# Altium schematic sheet fpga.SchDoc
size A3
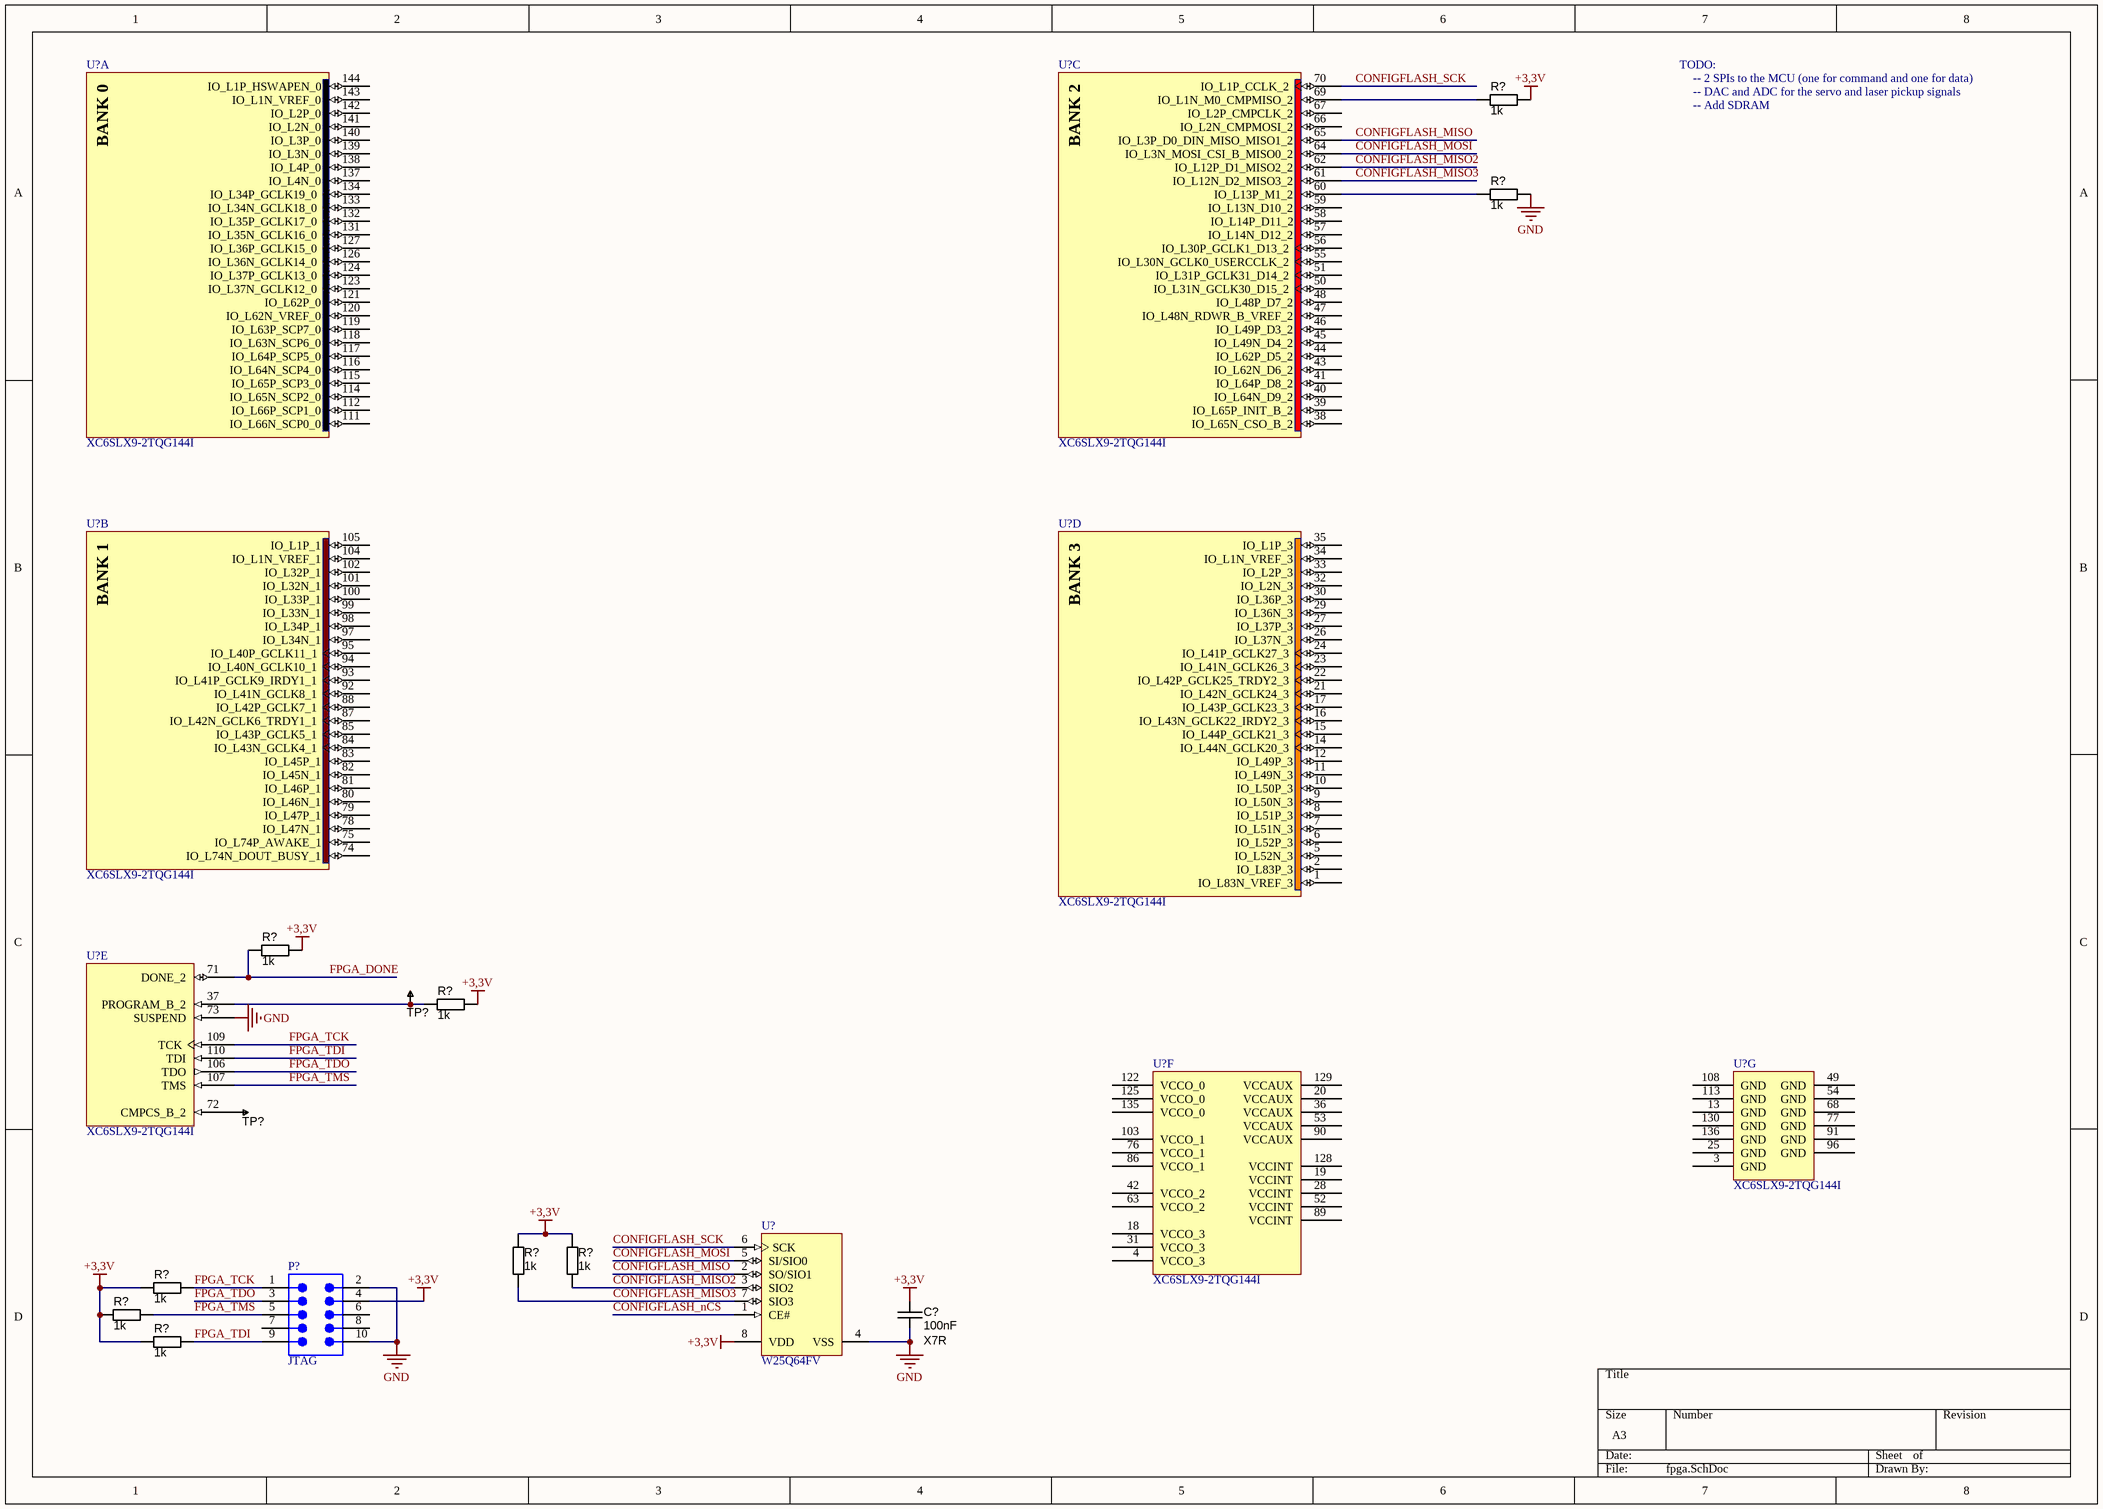
[diagram p0: fpga.SchDoc]

## Parts
(Parts that share a designator on the sheet are numbered #1, #2 ... from top to bottom, then left to right.)
C?  value 100nF  Temperature Coefficient: X7R  [CAPC2012X135N]  (hidden comment: 0805)
P?  JTAG  [918510x324]
R?#1  value 1k  [RESC2012N_ZERO]  (hidden comment: 0805)
R?#2  value 1k  [RESC2012N_ZERO]  (hidden comment: 0805)
R?#3  value 1k  [RESC2012N_ZERO]  (hidden comment: 0805)
R?#4  value 1k  [RESC2012N_ZERO]  (hidden comment: 0805)
R?#5  value 1k  [RESC2012N_ZERO]  (hidden comment: 0805)
R?#6  value 1k  [RESC2012N_ZERO]  (hidden comment: 0805)
R?#7  value 1k  [RESC2012N_ZERO]  (hidden comment: 0805)
R?#8  value 1k  [RESC2012N_ZERO]  (hidden comment: 0805)
R?#9  value 1k  [RESC2012N_ZERO]  (hidden comment: 0805)
TP?#1  TESTPOINT  [TP-R60]  (value not drawn)  (no BOM)
TP?#2  TESTPOINT  [TP-R60]  (value not drawn)  (no BOM)
U?#1  XC6SLX9-2TQG144I  [TQG144_M]  (part A of 7)
U?#2  XC6SLX9-2TQG144I  [TQG144_M]  (part C of 7)
U?#3  XC6SLX9-2TQG144I  [TQG144_M]  (part B of 7)
U?#4  XC6SLX9-2TQG144I  [TQG144_M]  (part D of 7)
U?#5  XC6SLX9-2TQG144I  [TQG144_M]  (part E of 7)
U?#6  XC6SLX9-2TQG144I  [TQG144_M]  (part F of 7)
U?#7  XC6SLX9-2TQG144I  [TQG144_M]  (part G of 7)
U?#8  W25Q64FV  [MCHP-SOIC-S2A8_M]

## Nets
+3,3V: C?.2 P?.4 R?#1.1 R?#3.1 R?#4.1 R?#5.2 R?#6.2 R?#7.1 R?#8.1 R?#9.1 U?#8.8(VDD)
GND: C?.1 P?.2 P?.10 R?#2.1 U?#5.73(SUSPEND) U?#8.4(VSS)
CONFIGFLASH_MISO: U?#2.65(IO_L3P_D0_DIN_MISO_MISO1_2) U?#8.2(SO/SIO1)
CONFIGFLASH_MISO2: R?#6.1 U?#2.62(IO_L12P_D1_MISO2_2) U?#8.3(SIO2)
CONFIGFLASH_MISO3: R?#5.1 U?#2.61(IO_L12N_D2_MISO3_2) U?#8.7(SIO3)
CONFIGFLASH_MOSI: U?#2.64(IO_L3N_MOSI_CSI_B_MISO0_2) U?#8.5(SI/SIO0)
CONFIGFLASH_nCS: U?#8.1(CE#)
CONFIGFLASH_SCK: U?#2.70(IO_L1P_CCLK_2) U?#8.6(SCK)
FPGA_DONE: R?#3.2 U?#5.71(DONE_2)
FPGA_TCK: P?.1 R?#7.2 U?#5.109(TCK)
FPGA_TDI: P?.9 R?#9.2 U?#5.110(TDI)
FPGA_TDO: P?.3 U?#5.106(TDO)
FPGA_TMS: P?.5 R?#8.2 U?#5.107(TMS)
NetR?#1_2: R?#1.2 U?#2.69(IO_L1N_M0_CMPMISO_2)
NetR?#2_2: R?#2.2 U?#2.60(IO_L13P_M1_2)
NetR?#4_2: R?#4.2 TP?#1.1 U?#5.37(PROGRAM_B_2)
NetTP?#2_1: TP?#2.1 U?#5.72(CMPCS_B_2)

Not connected (* = marked no-connect by the designer): P? 6 7 8; U?#1 111(IO_L66N_SCP0_0) 112(IO_L66P_SCP1_0) 114(IO_L65N_SCP2_0) 115(IO_L65P_SCP3_0) 116(IO_L64N_SCP4_0) 117(IO_L64P_SCP5_0) 118(IO_L63N_SCP6_0) 119(IO_L63P_SCP7_0) 120(IO_L62N_VREF_0) 121(IO_L62P_0) 123(IO_L37N_GCLK12_0) 124(IO_L37P_GCLK13_0) 126(IO_L36N_GCLK14_0) 127(IO_L36P_GCLK15_0) 131(IO_L35N_GCLK16_0) 132(IO_L35P_GCLK17_0) 133(IO_L34N_GCLK18_0) 134(IO_L34P_GCLK19_0) 137(IO_L4N_0) 138(IO_L4P_0) 139(IO_L3N_0) 140(IO_L3P_0) 141(IO_L2N_0) 142(IO_L2P_0) 143(IO_L1N_VREF_0) 144(IO_L1P_HSWAPEN_0); U?#2 38(IO_L65N_CSO_B_2) 39(IO_L65P_INIT_B_2) 40(IO_L64N_D9_2) 41(IO_L64P_D8_2) 43(IO_L62N_D6_2) 44(IO_L62P_D5_2) 45(IO_L49N_D4_2) 46(IO_L49P_D3_2) 47(IO_L48N_RDWR_B_VREF_2) 48(IO_L48P_D7_2) 50(IO_L31N_GCLK30_D15_2) 51(IO_L31P_GCLK31_D14_2) 55(IO_L30N_GCLK0_USERCCLK_2) 56(IO_L30P_GCLK1_D13_2) 57(IO_L14N_D12_2) 58(IO_L14P_D11_2) 59(IO_L13N_D10_2) 66(IO_L2N_CMPMOSI_2) 67(IO_L2P_CMPCLK_2); U?#3 74(IO_L74N_DOUT_BUSY_1) 75(IO_L74P_AWAKE_1) 78(IO_L47N_1) 79(IO_L47P_1) 80(IO_L46N_1) 81(IO_L46P_1) 82(IO_L45N_1) 83(IO_L45P_1) 84(IO_L43N_GCLK4_1) 85(IO_L43P_GCLK5_1) 87(IO_L42N_GCLK6_TRDY1_1) 88(IO_L42P_GCLK7_1) 92(IO_L41N_GCLK8_1) 93(IO_L41P_GCLK9_IRDY1_1) 94(IO_L40N_GCLK10_1) 95(IO_L40P_GCLK11_1) 97(IO_L34N_1) 98(IO_L34P_1) 99(IO_L33N_1) 100(IO_L33P_1) 101(IO_L32N_1) 102(IO_L32P_1) 104(IO_L1N_VREF_1) 105(IO_L1P_1); U?#4 1(IO_L83N_VREF_3) 2(IO_L83P_3) 5(IO_L52N_3) 6(IO_L52P_3) 7(IO_L51N_3) 8(IO_L51P_3) 9(IO_L50N_3) 10(IO_L50P_3) 11(IO_L49N_3) 12(IO_L49P_3) 14(IO_L44N_GCLK20_3) 15(IO_L44P_GCLK21_3) 16(IO_L43N_GCLK22_IRDY2_3) 17(IO_L43P_GCLK23_3) 21(IO_L42N_GCLK24_3) 22(IO_L42P_GCLK25_TRDY2_3) 23(IO_L41N_GCLK26_3) 24(IO_L41P_GCLK27_3) 26(IO_L37N_3) 27(IO_L37P_3) 29(IO_L36N_3) 30(IO_L36P_3) 32(IO_L2N_3) 33(IO_L2P_3) 34(IO_L1N_VREF_3) 35(IO_L1P_3); U?#6 4(VCCO_3) 18(VCCO_3) 19(VCCINT) 20(VCCAUX) 28(VCCINT) 31(VCCO_3) 36(VCCAUX) 42(VCCO_2) 52(VCCINT) 53(VCCAUX) 63(VCCO_2) 76(VCCO_1) 86(VCCO_1) 89(VCCINT) 90(VCCAUX) 103(VCCO_1) 122(VCCO_0) 125(VCCO_0) 128(VCCINT) 129(VCCAUX) 135(VCCO_0); U?#7 3(GND) 13(GND) 25(GND) 49(GND) 54(GND) 68(GND) 77(GND) 91(GND) 96(GND) 108(GND) 113(GND) 130(GND) 136(GND)

## Notes on the sheet
- TODO:
- -- Add SDRAM
- -- 2 SPIs to the MCU (one for command and one for data)
- -- DAC and ADC for the servo and laser pickup signals
- (in symbol XC6SLX9-2TQG144I, part A) BANK 0
- (in symbol XC6SLX9-2TQG144I, part B) BANK 1
- (in symbol XC6SLX9-2TQG144I, part C) BANK 2
- (in symbol XC6SLX9-2TQG144I, part D) BANK 3

## Library data of the parts
C? = CAPC_1u_0805_X7R_16V_10%: Capacitor SMD Cer X7R 0805; Tolerance: ±10%; Ratings: 16V; X7R; Material: ceramic; SCDType: spec; Package / Case: 0805 (2012 metric)
P? = 09 18 510 6324: Flat Cable Connector (IDC), Low-Profile Male Header, Straight Solder Pin, 10 Contacts, Performance Level 2; PCB_Layout: Complies with manufacturer's recommendation.; DrillSize: Corresponds to nominal value.; Published: 15-Nov-2004; DatasheetDocument: Sep-2003; PackageDocument: 03-Jun-2003; PackageReference: 918510x324; Publisher: Altium Limited; ComponentLink1Description: Manufacturer Link; ComponentLink1URL: http://www.harting.com/; ComponentLink2Description: Selection Guide; ComponentLink2URL: http://www.harting.com/imperia/md/content/steckverbinderundsystemkomponenten/folder/interface_engl_chapter_09.pdf
R?#1-R?#9 = RES_0R_0805: Resistor SMD chip 0.0 Ohm 0.125W 0805; Manufacturer 1: Samsung Electro-Mechanics America, Inc; Manufacturer Part Number 1: RC2012J000CS; Ratings: 1/8W; SCDType: spec; Tolerance: N/A; Package / Case: 0805 (2012 metric); Supplier 1: Digi-Key; Supplier Part Number 1: 1276-5466-6-ND; RoHS 1: RoHS Compliant; ComponentLink1URL: http://www.samsungsem.com/servlet/FileDownload?filename=productcatalog/pdf/Chip_Resistor.pdf; ComponentLink1Description: http://www.samsungsem.com/servlet/FileDownload?filename=productcatalog/pdf/Chip_Resistor.pdf; Supplier 2: Digi-Key; Supplier Part Number 2: RMCF0805ZT0R00DKR-ND; Manufacturer 2: Stackpole Electronics Inc; Manufacturer Part Number 2: RMCF0805ZT0R00; RoHS 2: RoHS Compliant; ComponentLink2URL: http://www.seielect.com/Catalog/SEI-RMCF_RMCP.pdf; ComponentLink2Description: http://www.seielect.com/Catalog/SEI-RMCF_RMCP.pdf; Supplier 3: Digi-Key; Supplier Part Number 3: 311-0.0ARDKR-ND; Manufacturer 3: Yageo; Manufacturer Part Number 3: RC0805JR-070RL; RoHS 3: RoHS Compliant; ComponentLink3URL: http://media.digikey.com/pdf/Data%20Sheets/Yageo%20PDFs/RC0805%20Pb%20Free.pdf; ComponentLink3Description: http://media.digikey.com/pdf/Data%20Sheets/Yageo%20PDFs/RC0805%20Pb%20Free.pdf; Supplier 4: Digi-Key; Supplier Part Number 4: P0.0ADKR-ND; Manufacturer 4: Panasonic Electronic Components; Manufacturer Part Number 4: ERJ-6GEY0R00V; RoHS 4: RoHS Compliant; ComponentLink4URL: http://industrial.panasonic.com/www-cgi/jvcr13pz.cgi?E+PZ+3+AOA0001+ERJ6GEY0R00V+7+WW; ComponentLink4Description: http://industrial.panasonic.com/www-cgi/jvcr13pz.cgi?E+PZ+3+AOA0001+ERJ6GEY0R00V+7+WW; Supplier 5: Digi-Key; Supplier Part Number 5: RHM0.0CPDKR-ND; Manufacturer 5: Rohm Semiconductor; Manufacturer Part Number 5: MCR10ERTJ000; RoHS 5: RoHS Compliant; ComponentLink5URL: http://rohmfs.rohm.com/en/products/databook/datasheet/passive/resistor/chip_resistor/mcr_g.pdf; ComponentLink5Description: http://rohmfs.rohm.com/en/products/databook/datasheet/passive/resistor/chip_resistor/mcr_g.pdf
TP?#1 TP?#2 = TESTPOINT: SMD test pin
U?#1-U?#7 = XC6SLX9-2TQG144I: Spartan-6 LX 1.2V FPGA, 102 User I/Os, 144-Pin TQFP (0.5mm Pitch), Speed Grade 2, Industrial Grade, Pb-Free; Published: 17-Nov-2009; DatasheetVersion: ver1.6, Nov-2010; PackageVersion: ver1.2, Jun-2004; PackageReference: TQG144; Publisher: Altium Limited; PackageDescription: 144-Pin Thin Quad Flat Pack (TQG144) - Pb-Free; Supplier 1: Digi-Key; Supplier Part Number 1: XC6SLX9-2TQG144I-ND; Code_JEDEC: MS-026-BFB; ComponentLink1Description: Manufacturer Link; ComponentLink1URL: http://www.xilinx.com; ComponentLink2Description: Spartan-6 Datasheet; ComponentLink2URL: http://www.xilinx.com/support/documentation/data_sheets/ds160.pdf; ComponentLink3Description: Spartan-6 Documents; ComponentLink3URL: http://www.xilinx.com/support/documentation/spartan-6.htm; ComponentLink4Description: Xilinx.com Home; ComponentLink4URL: http://www.xilinx.com
U?#8 = SST26VF032-80-5I-S2AE: 32 Mbit Serial Quad I/O (SQI) Flash Memory, 2.7 to 3.6 V, 80 MHz, -40 to 85 degC, 8-pin SOIC (S2A8), Tube; Manufacturer: Microchip; DatasheetVersion: Rev. A; PackageVersion: Rev. A; PackageReference: SOIC-S2A8; PackageDescription: 8-Lead Plastic Small Outline Intergrated Circuit, 5.275 x 5.275 mm Body, 1.27 mm Pitch; Supplier 1: Digi-Key; Supplier Part Number 1: SST26VF032-80-5I-S2AE-ND; Supplier 2: Newark; Supplier Part Number 2: 92R4616; Supplier 3: Mouser; Supplier Part Number 3: 579-26VF0328IS2AE; Mounting Technology: Surface Mount; PartNumber: SST26VF032-80-5I-S2AE; ComponentLink1Description: Manufacturer URL; ComponentLink1URL: http://www.microchip.com; ComponentLink2Description: Datasheet; ComponentLink2URL: http://ww1.microchip.com/downloads/en/DeviceDoc/25017A.pdf; ComponentLink3Description: Package Specification; ComponentLink3URL: http://ww1.microchip.com/downloads/en/DeviceDoc/25051A.pdf; ComponentLink4Description: Product URL; ComponentLink4URL: http://www.microchip.com/SST26VF032